# Altium schematic sheet Transceiver.SchDoc
size A
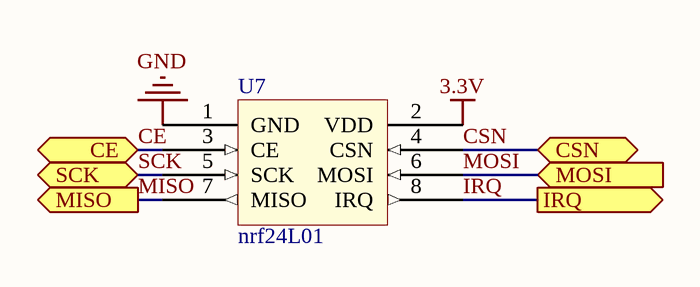
[diagram p0: Transceiver.SchDoc]

## Parts
U7  nrf24L01  [NRF24L01]

## Ports
CE, CSN, IRQ (out), MISO (out), MOSI (in), SCK

## Nets
3.3V: U7.2(VDD)
GND: U7.1(GND)
CE: U7.3(CE) ; port CE
CSN: U7.4(CSN) ; port CSN
IRQ: U7.8(IRQ) ; port IRQ
MISO: U7.7(MISO) ; port MISO
MOSI: U7.6(MOSI) ; port MOSI
SCK: U7.5(SCK) ; port SCK